# EAGLE design BMS Temp CAN Module(No ADCs) (EAGLE 7.6.0)
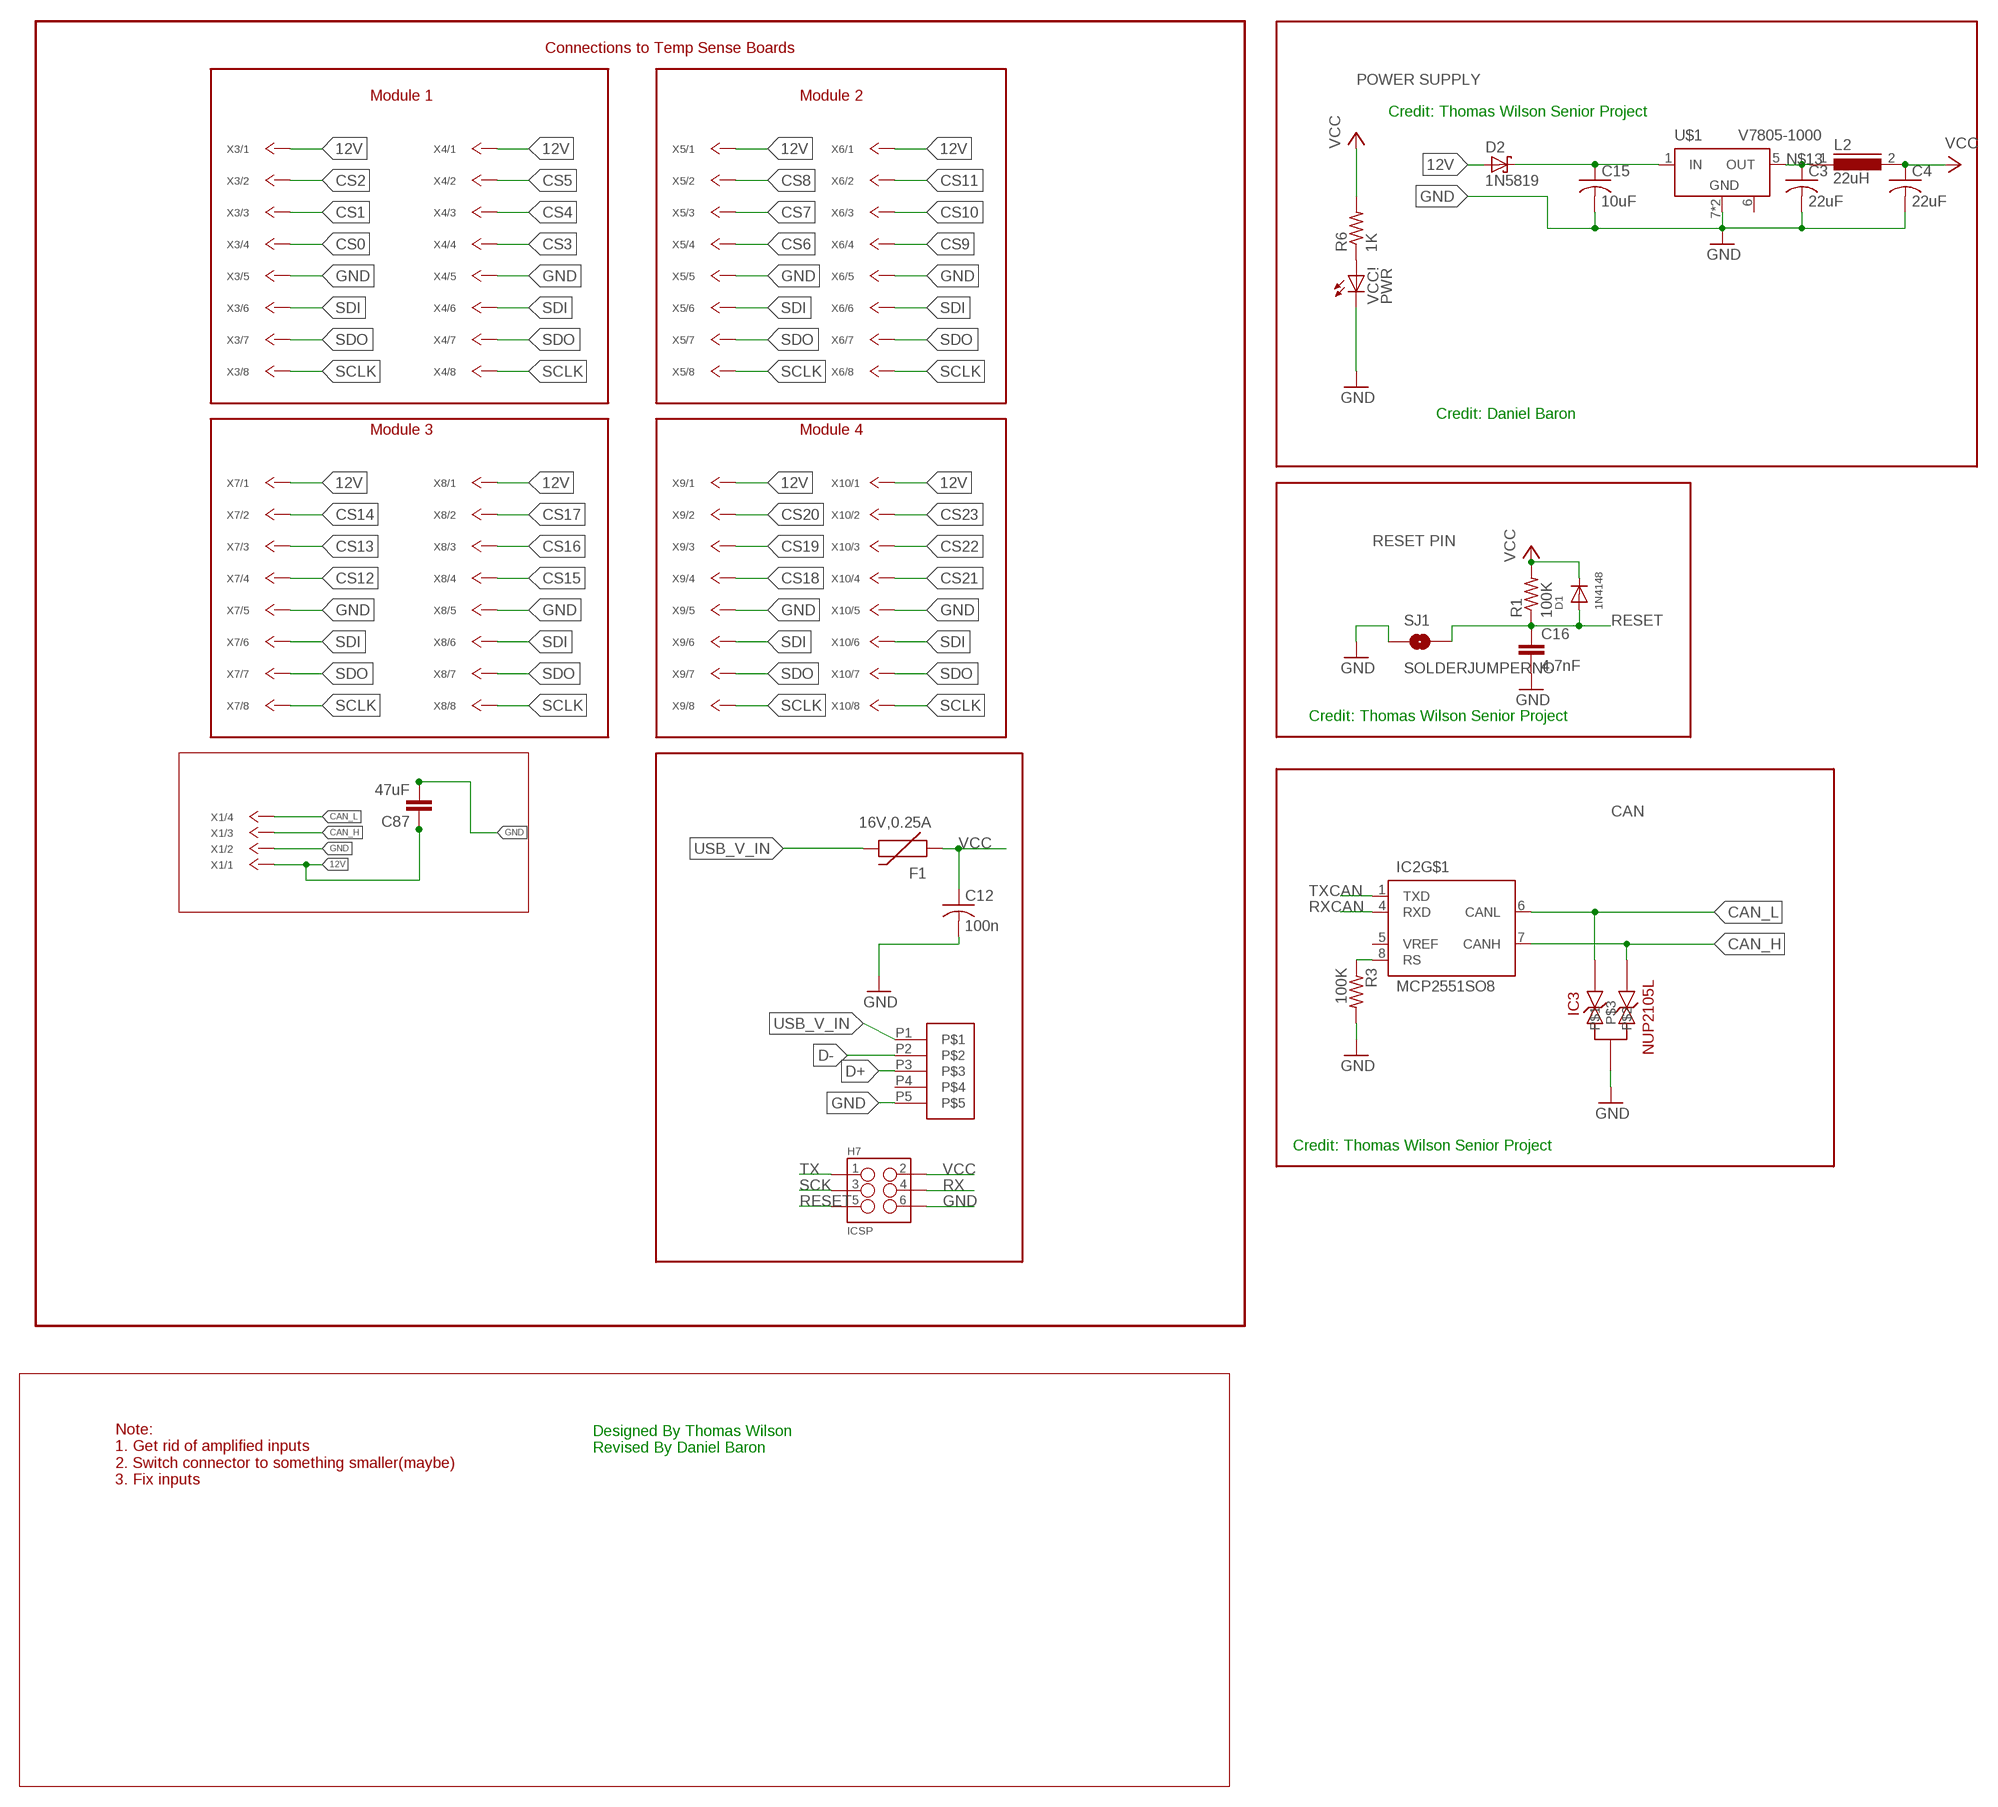
[diagram p0: schematic, sheet 1, part 1 of 2]
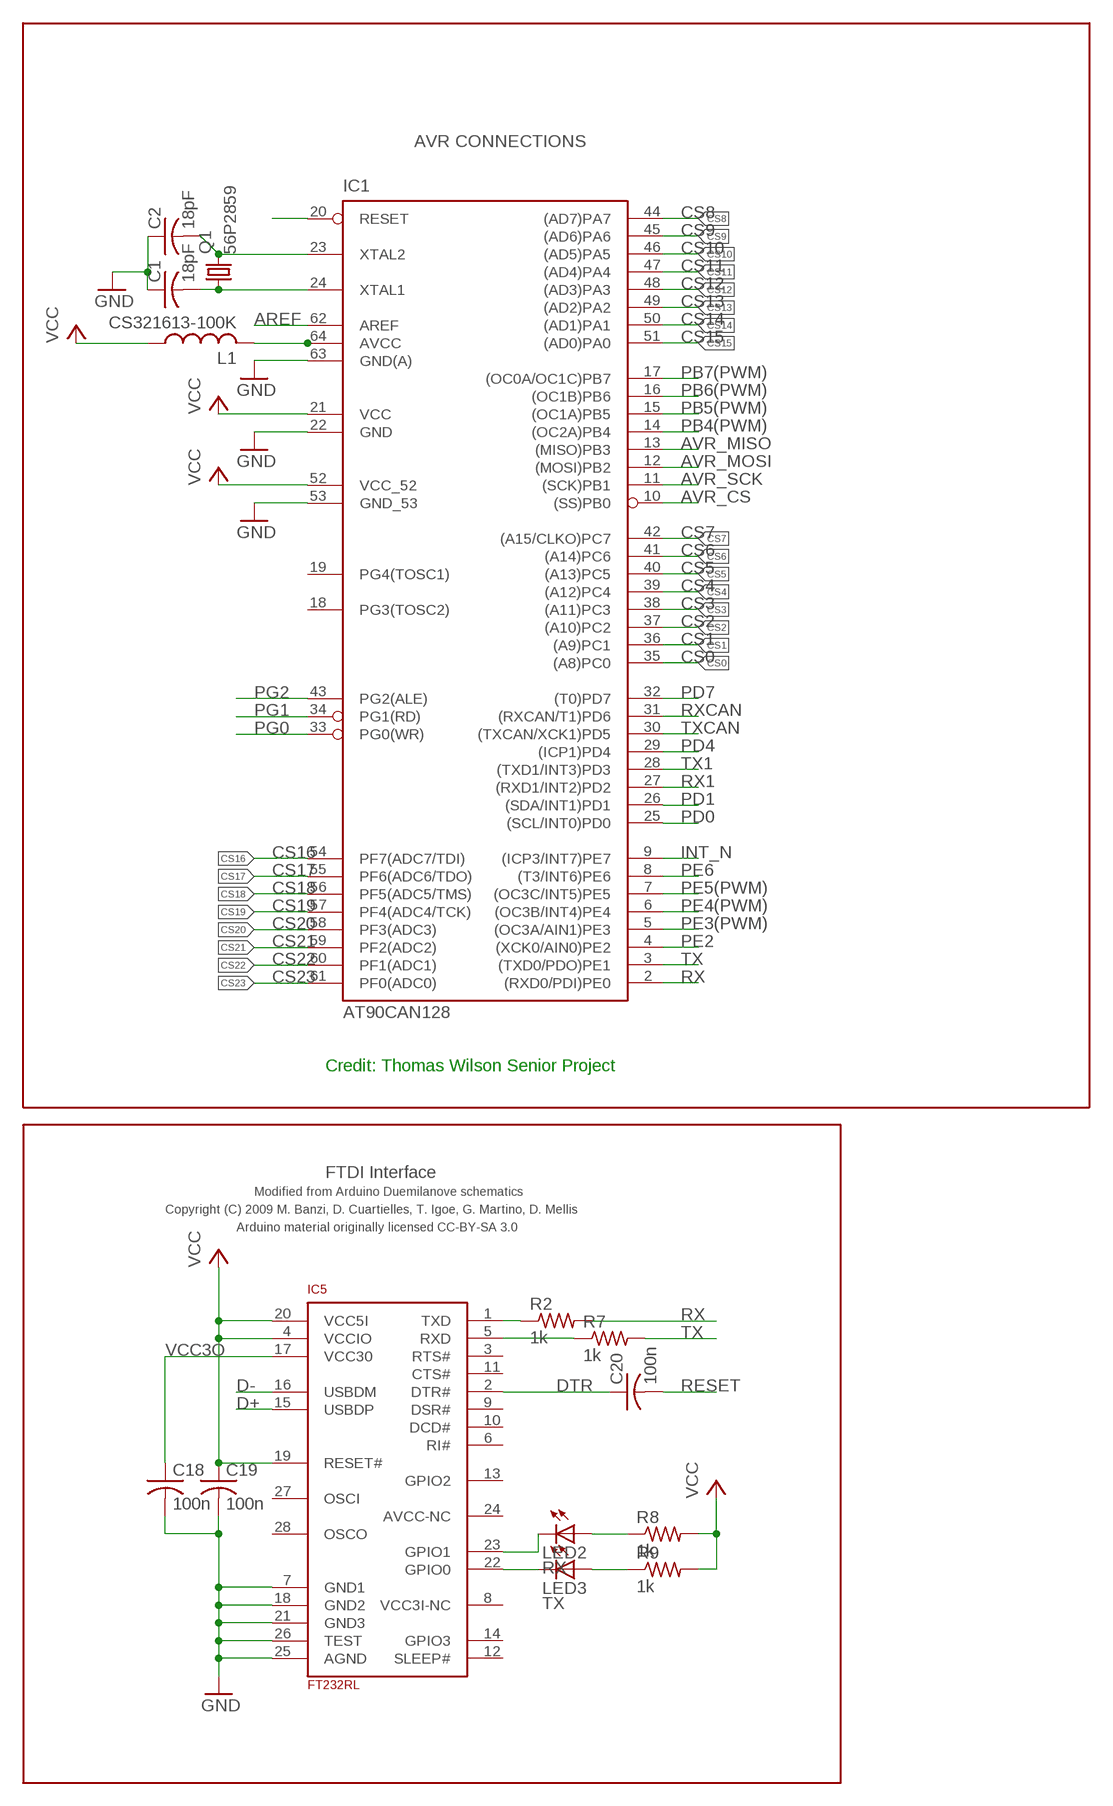
[diagram p1: schematic, sheet 1, part 2 of 2]

## Parts
C1  18pF  C-USC0805  [C0805]
C2  18pF  C-USC0805  [C0805]
C3  22uF  C-USC0805  [C0805]
C4  22uF  C-USC0805  [C0805]
C12  100n  C-USC0805  [C0805]
C15  10uF  C-USC0805  [C0805]
C16  4.7nF  CAP0603-CAP  [0603-CAP]
C18  100n  C-USC0805  [C0805]
C19  100n  C-USC0805  [C0805]
C20  100n  C-USC0805  [C0805]
C87  47uF  C-EUC0805  [C0805]
D1  1N4148  DIODESOD-123  [SOD-123]
D2  1N5819  1N5819-B  [DO41-7.6]
F1  16V,0.25A  PTCSMD  [PTC-1206]
H7  ICSP  M03X2SMD_FCI  [2X3_SMD_FCI_54202-G30]
IC1  AT90CAN128  [TQFP64]
IC2  MCP2551SO8  [SO08]
IC3  NUP2105L  [SOT-23]
IC5  FT232RL  [SSOP28]
L1  CS321613-100K  L-USL3216C  [L3216C]
L2  22uH  DR73  [DR73]
LED2  RX  LEDCHIPLED_0805  [CHIPLED_0805]
LED3  TX  LEDCHIPLED_0805  [CHIPLED_0805]
Q1  56P2859  CRYSTALSMD  [HC49UP]
R1  100K  R-US_R0805  [R0805]
R2  1k  R-US_R0805  [R0805]
R3  100K  R-US_R0805  [R0805]
R6  1K  R-US_R0805  [R0805]
R7  1k  R-US_R0805  [R0805]
R8  1k  R-US_R0805  [R0805]
R9  1k  R-US_R0805  [R0805]
SJ1  SOLDERJUMPERNO  [SJ_2S-NO]
U$1  V7805-1000  V78XX-1000  [V78XX-1000]
U$14  MUSBB  [MUSBB]
VCC!  PWR  LEDCHIPLED_0805  [CHIPLED_0805]
X1  4_PIN_CONN  [4_PIN_MOLEX]
X3  8_PIN_CONN  [8_PIN_MOLEX]
X4  8_PIN_CONN  [8_PIN_MOLEX]
X5  8_PIN_CONN  [8_PIN_MOLEX]
X6  8_PIN_CONN  [8_PIN_MOLEX]
X7  8_PIN_CONN  [8_PIN_MOLEX]
X8  8_PIN_CONN  [8_PIN_MOLEX]
X9  8_PIN_CONN  [8_PIN_MOLEX]
X10  8_PIN_CONN  [8_PIN_MOLEX]

## Nets
12V: C87.1 D2.A X1.P$1 X3.P$1 X4.P$1 X5.P$1 X6.P$1 X7.P$1 X8.P$1 X9.P$1 X10.P$1
12V_PROTECTED: C15.1 D2.C U$1.1(IN)
AREF: IC1.62(AREF)
AVR_CS: IC1.10((SS)PB0)
AVR_MISO: IC1.13((MISO)PB3)
AVR_MOSI: IC1.12((MOSI)PB2)
AVR_SCK: IC1.11((SCK)PB1)
CAN_H: IC2.7(CANH) IC3.2 X1.P$3
CAN_L: IC2.6(CANL) IC3.1 X1.P$4
CS0: IC1.35((A8)PC0) X3.P$4
CS1: IC1.36((A9)PC1) X3.P$3
CS2: IC1.37((A10)PC2) X3.P$2
CS3: IC1.38((A11)PC3) X4.P$4
CS4: IC1.39((A12)PC4) X4.P$3
CS5: IC1.40((A13)PC5) X4.P$2
CS6: IC1.41((A14)PC6) X5.P$4
CS7: IC1.42((A15/CLKO)PC7) X5.P$3
CS8: IC1.44((AD7)PA7) X5.P$2
CS9: IC1.45((AD6)PA6) X6.P$4
CS10: IC1.46((AD5)PA5) X6.P$3
CS11: IC1.47((AD4)PA4) X6.P$2
CS12: IC1.48((AD3)PA3) X7.P$4
CS13: IC1.49((AD2)PA2) X7.P$3
CS14: IC1.50((AD1)PA1) X7.P$2
CS15: IC1.51((AD0)PA0) X8.P$4
CS16: IC1.54(PF7(ADC7/TDI)) X8.P$3
CS17: IC1.55(PF6(ADC6/TDO)) X8.P$2
CS18: IC1.56(PF5(ADC5/TMS)) X9.P$4
CS19: IC1.57(PF4(ADC4/TCK)) X9.P$3
CS20: IC1.58(PF3(ADC3)) X9.P$2
CS21: IC1.59(PF2(ADC2)) X10.P$4
CS22: IC1.60(PF1(ADC1)) X10.P$3
CS23: IC1.61(PF0(ADC0)) X10.P$2
D+: IC5.15(USBDP) U$14.P3
D-: IC5.16(USBDM) U$14.P2
DTR: C20.1 IC5.2(DTR#)
GND: C1.1 C2.1 C3.2 C4.2 C12.2 C15.2 C16.2 C18.2 C19.2 C87.2 H7.6 IC1.22(GND) IC1.53(GND_53) IC1.63(GND(A)) IC3.3 IC5.7(GND1) IC5.18(GND2) IC5.21(GND3) IC5.25(AGND) IC5.26(TEST) R3.2 SJ1.1 U$1.7(GND) U$1.9(GND) U$14.P5 VCC!.C X1.P$2 X3.P$5 X4.P$5 X5.P$5 X6.P$5 X7.P$5 X8.P$5 X9.P$5 X10.P$5
GPIO0: IC5.22(GPIO0) LED3.C
GPIO1: IC5.23(GPIO1) LED2.C
INT_N: IC1.9((ICP3/INT7)PE7)
M8RXD: IC5.1(TXD) R2.1
M8TXD: IC5.5(RXD) R7.1
N$6: IC2.8(RS) R3.1
N$9: R6.1 VCC!.A
N$11: C1.2 IC1.24(XTAL1) Q1.1
N$13: C3.1 L2.1 U$1.5(OUT)
N$22: IC1.64(AVCC) L1.2
N$35: LED2.A R8.1
N$36: LED3.A R9.1
PB4(PWM): IC1.14((OC2A)PB4)
PB5(PWM): IC1.15((OC1A)PB5)
PB6(PWM): IC1.16((OC1B)PB6)
PB7(PWM): IC1.17((OC0A/OC1C)PB7)
PD0: IC1.25((SCL/INT0)PD0)
PD1: IC1.26((SDA/INT1)PD1)
PD4: IC1.29((ICP1)PD4)
PD7: IC1.32((T0)PD7)
PE2: IC1.4((XCK0/AIN0)PE2)
PE3(PWM): IC1.5((OC3A/AIN1)PE3)
PE4(PWM): IC1.6((OC3B/INT4)PE4)
PE5(PWM): IC1.7((OC3C/INT5)PE5)
PE6: IC1.8((T3/INT6)PE6)
PG0: IC1.33(PG0(WR))
PG1: IC1.34(PG1(RD))
PG2: IC1.43(PG2(ALE))
RESET: C16.1 C20.2 D1.A H7.5 IC1.20(RESET) R1.1 SJ1.2
RX: H7.4 IC1.2((RXD0/PDI)PE0) R2.2
RX1: IC1.27((RXD1/INT2)PD2)
RXCAN: IC1.31((RXCAN/T1)PD6) IC2.4(RXD)
SCK: H7.3
SCLK: X3.P$8 X4.P$8 X5.P$8 X6.P$8 X7.P$8 X8.P$8 X9.P$8 X10.P$8
SDI: X3.P$6 X4.P$6 X5.P$6 X6.P$6 X7.P$6 X8.P$6 X9.P$6 X10.P$6
SDO: X3.P$7 X4.P$7 X5.P$7 X6.P$7 X7.P$7 X8.P$7 X9.P$7 X10.P$7
TX: H7.1 IC1.3((TXD0/PDO)PE1) R7.2
TX1: IC1.28((TXD1/INT3)PD3)
TXCAN: IC1.30((TXCAN/XCK1)PD5) IC2.1(TXD)
USB_V_IN [usbvcc]: F1.2 U$14.P1
VCC: C4.1 C12.1 C19.1 D1.C F1.1 H7.2 IC1.21(VCC) IC1.52(VCC_52) IC5.4(VCCIO) IC5.19(RESET#) IC5.20(VCC5I) L1.1 L2.2 R1.2 R6.2 R8.2 R9.2
VCC3O: C18.1 IC5.17(VCC30)
XTAL1: C2.2 IC1.23(XTAL2) Q1.2
Unconnected: IC1.18(PG3(TOSC2)) IC1.19(PG4(TOSC1)) IC2.5(VREF) IC5.3(RTS#) IC5.6(RI#) IC5.8(VCC3I-NC) IC5.9(DSR#) IC5.10(DCD#) IC5.11(CTS#) IC5.12(SLEEP#) IC5.13(GPIO2) IC5.14(GPIO3) IC5.24(AVCC-NC) IC5.27(OSCI) IC5.28(OSCO) U$1.6 U$14.P4

## Notes on the sheet
- Connections to Temp Sense Boards
- POWER SUPPLY
- Module 1 | Module 2
- Credit: Thomas Wilson Senior Project
- AVR CONNECTIONS
- Credit: Daniel Baron
- Module 3 | Module 4
- RESET PIN
- Credit: Thomas Wilson Senior Project
- CAN
- Credit: Thomas Wilson Senior Project
- FTDI Interface
- Modified from Arduino Duemilanove schematics
- Copyright (C) 2009 M. Banzi, D. Cuartielles, T. Igoe, G. Martino, D. Mellis
- Arduino material originally licensed CC-BY-SA 3.0
- Credit: Thomas Wilson Senior Project
- Designed By Thomas Wilson
  Revised By Daniel Baron
- Note:
  1. Get rid of amplified inputs
  2. Switch connector to something smaller(maybe)
  3. Fix inputs

## Power pins joined to a net without a drawn wire
GND: IC2.2(GND)
VCC: IC2.3(VCC)

## Library data of the parts
C1 C2 C12 C18-C20 = rcl:C-US: CAPACITOR, American symbol
C3 C4 C15 = resistor:C-US: CAPACITOR, American symbol
C16 = SparkFun-Capacitors:CAP: Capacitor Standard 0603 ceramic capacitor, and 0.1" leaded capacitor.
C87 = rcl:C-EU: CAPACITOR, European symbol
D1 = adafruit:DIODE: Diode SMADIODE - SMA Surface Mount Package 20V 1A Schottky Diode Digikey: 641-1014-6-ND DO-1N4148 - Through Hole Small Current Diode SOD-123 20V 1 A (.5mV Vf) Schottky Diode - Digikey: MBRX120TPMSCT-ND SOD-323 10V 570mA (.38mV Vf, 3ns) Schottky Diode - Digikey: ZLLS410CT-ND SOD-523 30V 30mA Schottky Diode (RB751S-40TE61) - Digikey: RB751S-40TE61CT-ND SOT23-R/W - SOT23 Package (R = Solder Paste/Reflow Ovens, W = Hand-Soldering) BAT54Film 40V 300mA - Digikey: 497-7162-1-ND
D2 = diode:1N581*: 1.0A SCHOTTKY BARRIER RECTIFIER Source: http://www.diodes.com/datasheets/ds23001.pdf
F1 = SparkFun:PTC: Resettable Fuse PTC Resettable Fuse. Spark Fun Electronics SKU : COM-08357
H7 = SparkFun-Connectors:M03X2: 2x3 .1" header. Shrouded, with keying- CONN-10681 SMT- CONN-11415 Pogo pins- HW-11044
IC1 = at90can128:AT90CAN128
IC2 = can:MCP2551: CAN Tranceiver Microchip
IC3 = Artificial Science:NUP2105L
IC5 = SmartPrj:FT232RL
L1 = rcl:L-US: INDUCTOR, American symbol
L2 = inductors:DR73: High Power Density, High Efficiency, Shielded Inductors Source: coiltronics_dr_series.pdf
LED2 LED3 VCC! = led:LED: LED OSRAM: - CHIPLED LG R971, LG N971, LY N971, LG Q971, LY Q971, LO R971, LY R971 LH N974, LH R974 LS Q976, LO Q976, LY Q976 LO Q996 - Hyper CHIPLED LW Q18S LB Q993, LB Q99A, LB R99A - SideLED LS A670, LO A670, LY A670, LG A670, LP A670 LB A673, LV A673, LT A673, LW A673 LH A674 LY A675 LS A676, LA A676, LO A676, LY A676, LW A676 LS A679, LY A679, LG A679 - Hyper Micro SIDELED® LS Y876, LA Y876, LO Y876, LY Y876 LT Y87S - SmartLED LW L88C, LW L88S LB L89C, LB L89S, LG L890 LS L89K, LO L89K, LY L89K LS L896, LA L896, LO L896, LY L896 - TOPLED LS T670, LO T670, LY T670, LG T670, LP T670 LSG T670, LSP T670, LSY T670, LOP T670, LYG T670 LG T671, LOG T671, LSG T671 LB T673, LV T673, LT T673, LW T673 LH T674 LS T676, LA T676, LO T676, LY T676, LB T676, LH T676, LSB T676, LW T676 LB T67C, LV T67C, LT T67C, LS T67K, LO T67K, LY T67K, LW E67C LS E67B, LA E67B, LO E67B, LY E67B, LB E67C, LV E67C, LT E67C LW T67C LS T679, LY T679, LG T679 LS T770, LO T770, LY T770, LG T770, LP T770 LB T773, LV T773, LT T773, LW T773 LH T774 LS E675, LA E675, LY E675, LS T675 LS T776, LA T776, LO T776, LY T776, LB T776 LHGB T686 LT T68C, LB T68C - Hyper Mini TOPLED® LB M676 - Mini TOPLED Santana® LG M470 LS M47K, LO M47K, LY M47K Source: http://www.osram.convergy.de LUXEON: - LUMILED® LXK2-PW12-R00, LXK2-PW12-S00, LXK2-PW14-U00, LXK2-PW14-V00 LXK2-PM12-R00, LXK2-PM12-S00, LXK2-PM14-U00 LXK2-PE12-Q00, LXK2-PE12-R00, LXK2-PE12-S00, LXK2-PE14-T00, LXK2-PE14-U00 LXK2-PB12-K00, LXK2-PB12-L00, LXK2-PB12-M00, LXK2-PB14-N00, LXK2-PB14-P00, LXK2-PB14-Q00 LXK2-PR12-L00, LXK2-PR12-M00, LXK2-PR14-Q00, LXK2-PR14-R00 LXK2-PD12-Q00, LXK2-PD12-R00, LXK2-PD12-S00 LXK2-PH12-R00, LXK2-PH12-S00 LXK2-PL12-P00, LXK2-PL12-Q00, LXK2-PL12-R00 Source: www.luxeon.com KINGBRIGHT: KA-3528ASYC Source: www.kingbright.com
Q1 = SparkFun-FreqCtrl:CRYSTAL: Various standard crystals. Proven footprints. Spark Fun Electronics SKU : COM-00534
R1-R3 R6-R9 = rcl:R-US_: RESISTOR, American symbol
SJ1 = SparkFun-Passives:SOLDERJUMPER: Solder Jumper Standard SMD solder jumper. Used to automate production. Two varients : Normally Open and Normally Closed are the same, but have different paste layers. NC will have a large amount of paste and should jumper during reflow.
U$1 = formula electric:V78XX-1000
U$14 = DashAndCAN library:MUSBB
X1 = BMS Lbr:4_PIN_CONN
X3-X10 = BMS Lbr:8_PIN_CONN

## Board
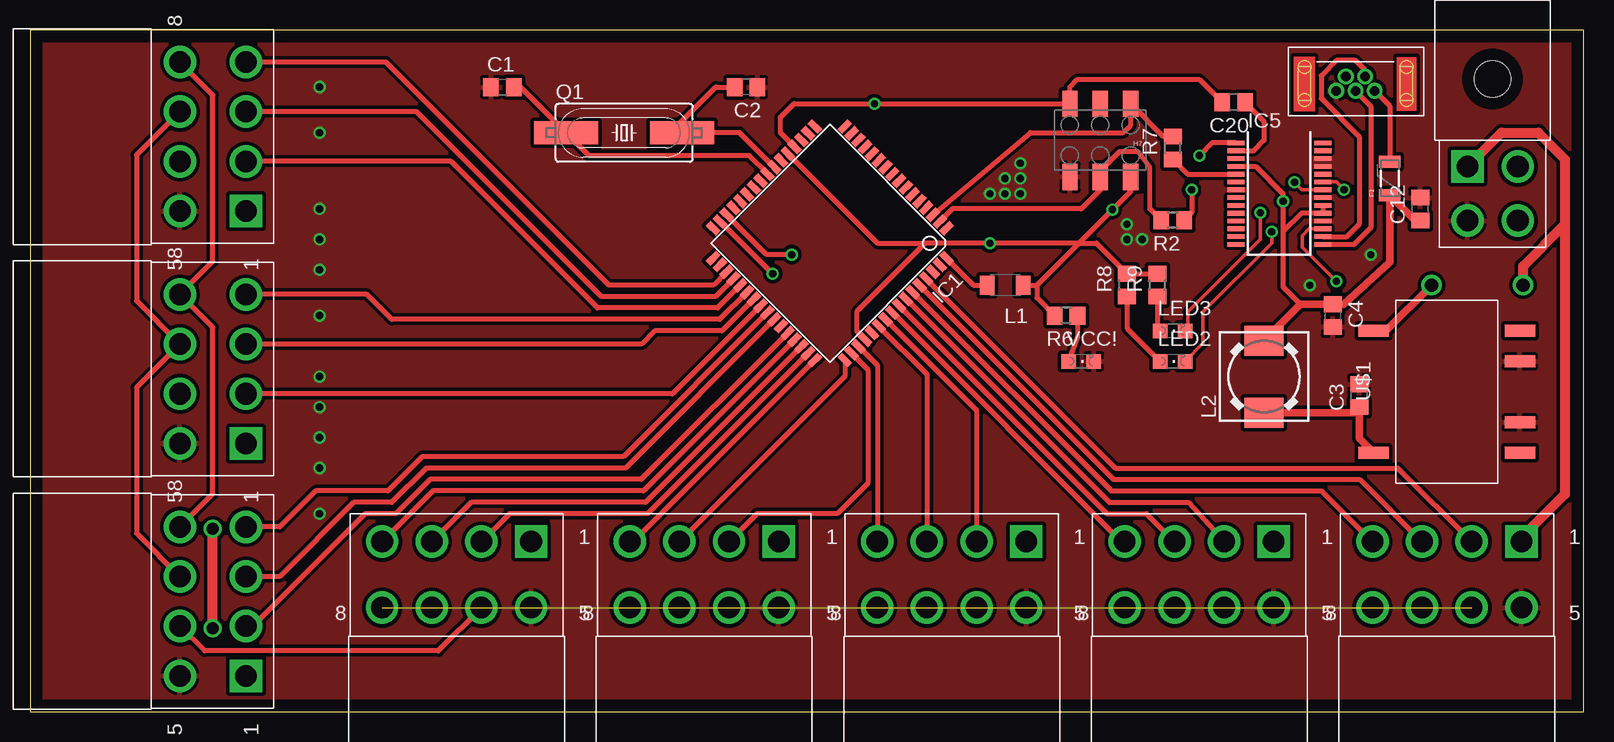
[diagram p2: board, top side]
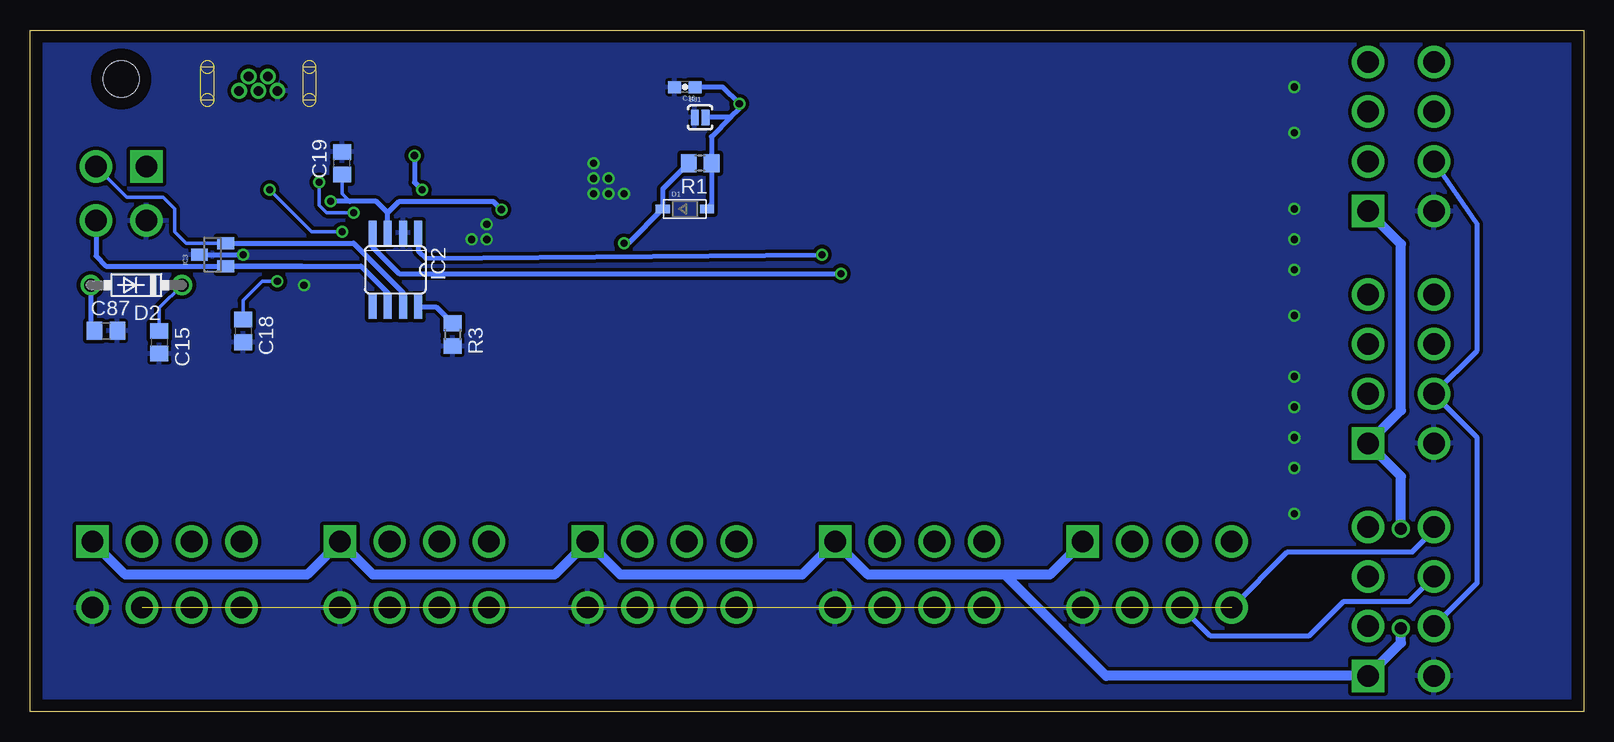
[diagram p3: board, bottom side, seen from below]

Size 129.52 x 56.82 mm. Coordinates in mm from the lower left corner, seen from the top.
Outline: 0,0 129.52,0 129.52,56.82 0,56.82 0,0
Copper layers (1*16): Top 0.035mm / dielectric 1.5mm / Bottom 0.035mm
Design rules "default": minimum track width 10mil, minimum drill 24mil, track to track 8mil, track to pad 8mil, pad to pad 8mil, via to via 8mil, smd to smd 8mil, copper to edge 40mil, drill to drill 8mil, minimum pad ring 10mil, minimum via ring 8mil, stop-mask expansion 4mil, vias tented up to drill 0mil, thermal gap 10mil

### Footprints (pad centres in the part's own frame; a part is rotated, then mirrored left to right if it is on the bottom)
C0805 = smd 1.3 x 1.5: 1 -0.95,0; 2 0.95,0
0603-CAP = smd 1.1 x 1: 1 -0.85,0; 2 0.85,0
SOD-123 = smd 1.2 x 0.7: A 1.85,0; C -1.85,0
DO41-7.6 = drill 1.1 pad 1.7: A 3.81,0; C -3.81,0
PTC-1206 = smd 1 x 1.8: 1 -1.4,0; 2 1.4,0
2X3_SMD_FCI_54202-G30 = smd 1.27 x 2.18: 1 -2.54,-3.05; 2 -2.54,3.05; 3 0,-3.05; 4 0,3.05; 5 2.54,-3.05; 6 2.54,3.05
TQFP64 = smd 1.194 x 0.559: 1 -7.76,6; 2 -7.76,5.2; 3 -7.76,4.4; 4 -7.76,3.6; 5 -7.76,2.8; 6 -7.76,2; 7 -7.76,1.2; 8 -7.76,0.4; 9 -7.76,-0.4; 10 -7.76,-1.2; 11 -7.76,-2; 12 -7.76,-2.8; 13 -7.76,-3.6; 14 -7.76,-4.4; 15 -7.76,-5.2; 16 -7.76,-6; 33 7.76,-6; 34 7.76,-5.2; 35 7.76,-4.4; 36 7.76,-3.6; 37 7.76,-2.8; 38 7.76,-2; 39 7.76,-1.2; 40 7.76,-0.4; 41 7.76,0.4; 42 7.76,1.2; 43 7.76,2; 44 7.76,2.8; 45 7.76,3.6; 46 7.76,4.4; 47 7.76,5.2; 48 7.76,6 | smd 0.559 x 1.194: 17 -6,-7.76; 18 -5.2,-7.76; 19 -4.4,-7.76; 20 -3.6,-7.76; 21 -2.8,-7.76; 22 -2,-7.76; 23 -1.2,-7.76; 24 -0.4,-7.76; 25 0.4,-7.76; 26 1.2,-7.76; 27 2,-7.76; 28 2.8,-7.76; 29 3.6,-7.76; 30 4.4,-7.76; 31 5.2,-7.76; 32 6,-7.76; 49 6,7.76; 50 5.2,7.76; 51 4.4,7.76; 52 3.6,7.76; 53 2.8,7.76; 54 2,7.76; 55 1.2,7.76; 56 0.4,7.76; 57 -0.4,7.76; 58 -1.2,7.76; 59 -2,7.76; 60 -2.8,7.76; 61 -3.6,7.76; 62 -4.4,7.76; 63 -5.2,7.76; 64 -6,7.76
SO08 = smd 0.66 x 2.032: 1 -1.905,-3.073; 2 -0.635,-3.073; 3 0.635,-3.073; 4 1.905,-3.073; 5 1.905,3.073; 6 0.635,3.073; 7 -0.635,3.073; 8 -1.905,3.073
SOT-23 = smd 1 x 1.4: 1 -0.95,-1.1; 2 0.95,-1.1; 3 0,1.1
SSOP28 = smd 0.381 x 1.499: 1 -4.225,-3.625; 2 -3.575,-3.625; 3 -2.925,-3.625; 4 -2.275,-3.625; 5 -1.625,-3.625; 6 -0.975,-3.625; 7 -0.325,-3.625; 8 0.325,-3.625; 9 0.975,-3.625; 10 1.625,-3.625; 11 2.275,-3.625; 12 2.925,-3.625; 13 3.575,-3.625; 14 4.225,-3.625; 15 4.225,3.625; 16 3.575,3.625; 17 2.925,3.625; 18 2.275,3.625; 19 1.625,3.625; 20 0.975,3.625; 21 0.325,3.625; 22 -0.325,3.625; 23 -0.975,3.625; 24 -1.625,3.625; 25 -2.275,3.625; 26 -2.925,3.625; 27 -3.575,3.625; 28 -4.225,3.625
L3216C = smd 1.2 x 1.6: 1 -1.5,0; 2 1.5,0
DR73 = smd 2.5 x 3.25: 1 -3,0; 2 3,0
CHIPLED_0805 = smd 1.2 x 1.2: A 0,-1.05; C 0,1.05
HC49UP = smd 5.334 x 1.93: 1 -4.826,0; 2 4.826,0
R0805 = smd 1.3 x 1.5: 1 -0.95,0; 2 0.95,0
SJ_2S-NO = smd 0.635 x 1.27: 1 -0.45,0; 2 0.45,0
V78XX-1000 = smd 1 x 2.54: 1 -5.08,-6.096; 5 5.08,-6.096; 6 5.08,6.096; 7 2.54,6.096; 9 -2.54,6.096; 10 -5.08,6.096
MUSBB = drill 0.8: P1 -1.6,0; P2 -0.8,-1.2; P3 0,0; P4 0.8,-1.2; P5 1.6,0
4_PIN_MOLEX = drill 1.8 square: P$1 2.1,-2.25 | drill 1.8: P$2 2.1,2.25; P$3 -2.1,-2.25; P$4 -2.1,2.25 | hole 3: 0,-9.55
8_PIN_MOLEX = drill 1.8 square: P$1 6.21,2.75 | drill 1.8: P$2 2.07,2.75; P$3 -2.07,2.75; P$4 -6.21,2.75; P$5 6.21,-2.75; P$6 2.07,-2.75; P$7 -2.07,-2.75; P$8 -6.21,-2.75

### Placement (x,y rotation side)
C1  39.37,52.07 0 top
C2  59.69,52.07 180 top
C3  110.81,26.35 90 top
C4  108.58,33.02 270 top
C12  115.89,41.91 90 top
C15  118.75,30.8 270 bottom
C16  74.93,52.07 180 bottom
C18  111.76,31.75 270 bottom
C19  103.5,45.72 90 bottom
C20  100.33,50.8 180 top
C87  123.19,31.75 0 bottom
D1  74.93,41.91 0 bottom
D2  120.65,35.56 180 bottom
F1  113.35,44.45 90 top
H7  89.22,47.62 180 top
IC1  66.67,39.05 225 top
IC2  99.06,36.83 180 bottom
IC3  114.3,38.1 90 bottom
IC5  104.14,43.18 270 top
L1  81.28,35.56 180 top
L2  102.87,27.94 90 top
LED2  95.25,29.21 270 top
LED3  95.25,31.75 270 top
Q1  49.53,48.26 0 top
R1  73.66,45.72 180 bottom
R2  95.25,40.96 180 top
R3  94.3,31.43 270 bottom
R6  86.36,33.02 180 top
R7  95.25,46.99 90 top
R8  91.44,35.56 90 top
R9  93.98,35.56 90 top
SJ1  73.66,49.53 0 bottom
U$1  118.11,26.67 270 top
U$14  110.49,51.75 180 top
VCC!  87.63,29.21 270 top
X1  121.92,43.18 180 top
X3  15.24,47.94 270 top
X4  15.24,28.57 270 top
X5  15.24,9.21 270 top
X6  35.56,11.43 0 top
X7  56.2,11.43 0 top
X8  76.83,11.43 0 top
X9  97.47,11.43 0 top
X10  118.11,11.43 0 top

### Tracks (layer width: path | path; a pad name or v marks a point on that pad's centre or on a via)
12V  (via drill 1)
  Top 0.813: 127.95,40.64 127.95,18.13 124.32,14.5 | D2.A 124.46,37.15 127.95,40.64 | X1.P$1 122.65,48.26 125.73,48.26 127.95,46.04 127.95,40.64 | v15.24,6.99 v15.24,15.24
  Top 1.27: 124.32,14.5 X10.P$1
  Bottom 0.406: D2.A 124.46,32.07 C87.1
  Bottom 0.813: X6.P$1 44.52,11.43 48.26,11.43 | 48.26,11.43 59.66,11.43 X7.P$1 65.16,11.43 80.3,11.43 X8.P$1 85.8,11.43 100.93,11.43 X9.P$1 106.43,11.43 121.57,11.43 X10.P$1 | v15.24,6.99 15.24,5.75 X5.P$1 39.83,3 48.26,11.43 | v15.24,15.24 15.24,19.61 X4.P$1 15.24,25.11 15.24,38.98 X3.P$1
12V_PROTECTED
  Top 0.61: D2.C 113.03,31.75 U$1.1
  Bottom 0.305: D2.C 118.75,33.66 C15.1
CAN_H
  Bottom 0.305: IC3.2 116.52,39.05 117.47,40.01 117.47,41.91 118.43,42.86 121.45,42.86 X1.P$3
  Bottom 0.406: IC3.2 102.55,39.05 98.42,34.92 IC2.7
CAN_L
  Bottom 0.406: X1.P$4 124.02,37.98 123.19,37.15 106.85,37.15 | 106.85,37.15 IC3.1 | 106.85,37.15 101.92,37.15 99.69,34.92 IC2.6
CS0
  Top 0.406: IC1.35 56.96,35.56 48.26,35.56 29.67,54.15 X3.P$4
CS1
  Top 0.406: IC1.36 57.14,34.61 47.62,34.61 32.22,50.01 X3.P$3
CS2
  Top 0.406: IC1.37 57.32,33.66 47.31,33.66 35.09,45.87 X3.P$2
CS3
  Top 0.406: IC1.38 57.5,32.7 30.16,32.7 28.08,34.78 X4.P$4
CS4
  Top 0.406: IC1.39 57.67,31.75 52.07,31.75 50.97,30.64 X4.P$3
CS5
  Top 0.406: IC1.40 53.56,26.5 X4.P$2
CS6
  Top 0.406: IC1.41 49.46,21.27 32.7,21.27 29.84,18.41 23.81,18.41 20.82,15.42 X5.P$4
CS7
  Top 0.406: IC1.42 49.64,20.32 33.02,20.32 30.16,17.46 26.99,17.46 20.8,11.28 X5.P$3
CS8
  Top 0.406: IC1.44 50.95,19.37 33.34,19.37 30.48,16.51 27.94,16.51 18.57,7.14 X5.P$2
CS9
  Top 0.406: IC1.45 51.13,18.41 33.59,18.41 X6.P$4
CS10
  Top 0.406: IC1.46 51.31,17.46 36.77,17.46 X6.P$3
CS11
  Top 0.406: IC1.47 51.49,16.51 39.96,16.51 X6.P$2
CS12
  Top 0.406: IC1.48 50.29,14.18 X7.P$4
CS13
  Top 0.406: IC1.49 67.92,27.97 X7.P$3
CS14
  Top 0.406: IC1.50 69.85,28.52 69.85,19.05 67.31,16.51 60.6,16.51 X7.P$2
CS15
  Top 0.406: IC1.51 70.62,28.88 X8.P$4
CS16
  Top 0.406: IC1.54 74.77,28.13 X8.P$3
CS17
  Top 0.406: IC1.55 78.91,25.12 X8.P$2
CS18
  Top 0.406: IC1.56 90.98,14.18 X9.P$4
CS19
  Top 0.406: IC1.57 89.78,16.51 93.07,16.51 X9.P$3
CS20
  Top 0.406: IC1.58 89.96,17.46 96.58,17.46 X9.P$2
CS21
  Top 0.406: IC1.59 90.14,18.41 107.67,18.41 X10.P$4
CS22
  Top 0.406: IC1.60 90.32,19.37 110.85,19.37 X10.P$3
CS23
  Top 0.406: IC1.61 90.5,20.32 114.04,20.32 X10.P$2
D+
  Top 0.406: U$14.P3 111.76,50.48 111.76,40.32 110.39,38.95 IC5.15
D-
  Top 0.406: U$14.P2 111.29,53.49 110.49,54.29 108.9,54.29 107.63,53.02 107.63,51.12 110.81,47.94 110.81,40.64 109.77,39.6 IC5.16
DTR
  Top 0.406: C20.1 102.87,49.21 102.87,47.62 102,46.76 IC5.2
GND  (via drill 0.6)
  Bottom 0.406: IC3.3 v111.76,38.1
  other vias: 80.01,43.18 81.28,43.18 82.55,43.18 81.28,44.45 82.55,44.45 82.55,45.72 106.68,35.56 91.44,40.64 91.44,39.37 92.71,39.37 24.13,16.51 24.13,20.32 24.13,22.86 24.13,25.4 24.13,27.94 24.13,33.02 24.13,36.83 24.13,39.37 24.13,41.91 24.13,48.26 24.13,52.07
  pour Top (isolate 0.305, rank 6): 0,0 129.54,0 129.54,57.15 0,57.15
  pour Bottom (isolate 0.305, rank 6): 0,0 129.54,0 128.27,57.15 0,57.15
  pour Top (isolate 0.254, no thermals): 97.79,38.1 110.49,38.1 110.49,48.9 97.79,48.9
GPIO0  (via drill 0.6)
  Top 0.305: IC5.22 106.04,43.51 v105.41,44.13 | v102.55,41.59 102.55,39.37 96.52,33.34 96.52,31.97 LED3.C
  Bottom 0.305: v105.41,44.13 105.41,42.23 104.78,41.59 v102.55,41.59
GPIO1  (via drill 0.6)
  Top 0.305: IC5.23 108.88,44.16 v109.54,43.5 | 103.19,40.01 v103.5,40.01 103.5,39.05 97.79,33.34 97.79,30.7 LED2.C
  Bottom 0.305: v109.54,43.5 106.05,40.01 v103.5,40.01
M8RXD  (via drill 0.6)
  Top 0.406: IC5.1 98.52,47.41 v97.47,46.35 | v96.84,43.5 96.84,41.59 R2.1
  Bottom 0.406: v97.47,46.35 97.47,44.13 v96.84,43.5
M8TXD
  Top 0.406: R7.1 96.48,44.8 IC5.5
N$6
  Bottom 0.406: IC2.8 95.67,33.76 R3.1
N$9
  Top 0.406: R6.1 87.31,31.21 VCC!.A
N$11
  Top 0.406: IC1.24 59.94,46.35 46.61,46.35 Q1.1 40.89,52.07 C1.2
N$13
  Top 0.61: U$1.5 110.81,22.8 C3.1 110.34,24.94 L2.1
N$22
  Top 0.406: IC1.64 78.65,35.56 L1.2
N$35
  Top 0.406: R8.1 91.44,31.97 LED2.A
N$36
  Top 0.406: R9.1 93.98,31.97 LED3.A
RESET  (via drill 0.6)
  Top 0.406: IC1.20 62.55,48.27 62.55,49.53 63.69,50.67 v70.39,50.67 H7.5 86.68,52.07 87.31,52.7 97.47,52.7 C20.2
  Bottom 0.406: 71.12,49.53 70.39,50.26 v70.39,50.67 71.78,52.07 C16.1 | 71.12,49.53 SJ1.2 | 71.12,49.53 72.71,47.94 R1.1 72.71,42.28 D1.A
RX
  Top 0.406: IC1.2 76.89,41.91 87.63,41.91 89.22,43.5 H7.4 89.22,45.09 90.81,46.67 92.39,46.67 93.34,45.4 93.34,45.09 93.35,41.91 R2.2
RXCAN  (via drill 0.6)
  Top 0.406: v61.91,36.51 61.54,36.83 IC1.31
  Bottom 0.406: IC2.4 100.97,38.73 98.74,36.51 v61.91,36.51
SCLK  (4 unrouted)
  Top 0.406: X5.P$8 15.24,18.17 15.24,32.03 X4.P$8 15.24,37.53 15.24,51.4 X3.P$8
  Bottom 0.406: X6.P$8 24.7,13.34 14.29,13.34 12.49,15.13 X5.P$8
SDI  (4 unrouted)
  Top 0.406: X6.P$6 34.03,5.08 14.55,5.08 X5.P$6
  Bottom 0.406: X5.P$6 8.89,10.74 8.89,22.86 12.49,26.46 X4.P$6 8.89,30.11 8.89,40.64 X3.P$6
SDO  (4 unrouted)
  Top 0.406: X3.P$7 8.89,46.41 8.89,34.24 X4.P$7 8.89,27.05 8.89,14.88 X5.P$7
  Bottom 0.406: X6.P$7 31.16,6.35 22.86,6.35 20,9.21 14.56,9.21 X5.P$7
TX
  Top 0.406: IC1.3 83.38,48.26 91.12,48.26 91.76,48.9 H7.1 | 91.76,50.48 H7.1 | R7.2 94.49,47.94 H7.1
TXCAN  (via drill 0.6)
  Top 0.406: v63.5,38.1 61.41,38.1 IC1.30
  Bottom 0.406: IC2.1 97.16,38.42 96.52,37.78 v63.5,38.1
USB_V_IN
  Top 0.406: U$14.P1 113.35,50.49 F1.2
VCC  (via drill 0.6)
  Top 0.406: IC5.20 IC5.19 106.01,41.55 104.46,40.01 | H7.2 91.76,43.39 v90.22,41.86 87.42,39.05 | 87.42,39.05 v80.01,39.05 74.61,39.05 | 74.61,39.05 68.9,33.34 68.9,31.75 IC1.52 | IC1.21 70.64,39.05 74.61,39.05 | 104.46,40.01 104.46,35.41 105.9,33.97 | IC5.4 102.18,45.45 104.46,43.18 v104.46,42.55 104.46,40.01 | L1.1 83.92,35.56 | 83.92,35.56 87.42,39.05 | 83.92,35.56 83.92,34.51 R6.2 | 87.42,39.05 88.9,39.05 R8.2 R9.2
  Top 0.61: C12.1 115.44,40.95 F1.1 113.35,37.47 109.53,33.97 C4.1 105.9,33.97 L2.2
  Bottom 0.305: C19.1 103.5,43.18 102.87,42.55
  Bottom 0.406: R1.2 76.78,43.55 D1.C 79.64,39.05 v80.01,39.05 | 90.28,41.91 v90.22,41.86 90.91,42.55 98.74,42.55 99.69,41.59 | IC2.3 99.69,41.59 | 99.69,41.59 100.65,42.55 102.87,42.55 v104.46,42.55
VCC3O  (via drill 0.6)
  Top 0.305: IC5.17 106.61,40.26 106.05,39.69 106.05,38.73 v108.9,35.88
  Bottom 0.305: v108.9,35.88 110.17,35.88 111.76,34.29 C18.1
XTAL1
  Top 0.406: IC1.23 59.16,48.26 Q1.2 53.34,48.26 57.15,52.07 C2.2